# Altium project KeyBoard.PrjPcb
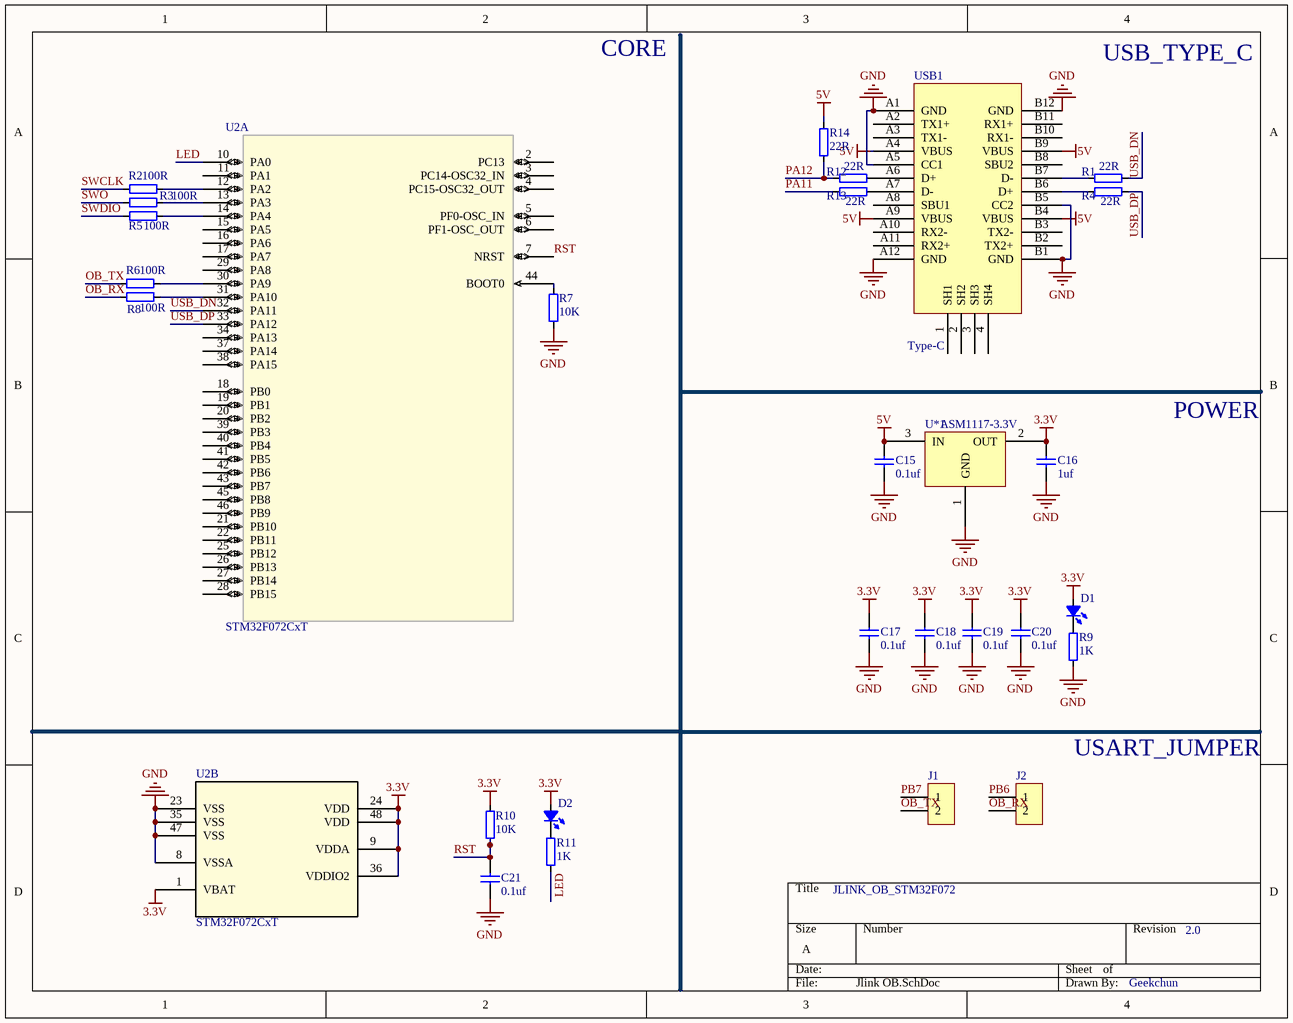
[diagram p0: Jlink OB.SchDoc]
3 sheets, 71 parts. Net scope: global (net labels, ports and power ports of the same name join across sheets).
Board file: KeyBoard.PcbDoc
Sheets:
  Jlink OB.SchDoc
  STM32F103C8T6.SchDoc
  Key&Led.SchDoc

## Sheet Jlink OB.SchDoc
size A

### Parts
C15  0.1uf  [C 0603_L]
C16  1uf  [C 0603_L]
C17  0.1uf  [C 0603_L]
C18  0.1uf  [C 0603_L]
C19  0.1uf  [C 0603_L]
C20  0.1uf  [C 0603_L]
C21  0.1uf  [C 0603_L]
D1  LED_0603  [LED 0603B]  (value not drawn)
D2  LED_0603  [LED 0603B]  (value not drawn)
J1  USART JUMPER  [HDR2.54-LI-2P]  (value not drawn)
J2  USART JUMPER  [HDR2.54-LI-2P]  (value not drawn)
R1  22R  [R 0603_L]
R2  100R  [R 0603_L]
R3  100R  [R 0603_L]
R4  22R  [R 0603_L]
R5  100R  [R 0603_L]
R6  100R  [R 0603_L]
R7  10K  [R 0603_L]
R8  100R  [R 0603_L]
R9  1K  [R 0603_L]
R10  10K  [R 0603_L]
R11  1K  [R 0603_L]
R12  22R  [R 0603_L]
R13  22R  [R 0603_L]
R14  22R  [R 0603_L]
U2  STM32F072CxT  [LQFP48 7X7_L]  (parts A,B of 2)
U*1  ASM1117-3.3V  [SOT223_L]
USB1  Type-C  [usb typec]

### Nets
3.3V: C16.2 C17.2 C18.2 C19.2 C20.2 D1.1(A) D2.1(A) R10.2 U2.1(VBAT) U2.9(VDDA) U2.24(VDD) U2.36(VDDIO2) U2.48(VDD) U*1.2(OUT)
5V: C15.2 R14.2 U*1.3(IN) USB1.A4(VBUS) USB1.A9(VBUS) USB1.B4(VBUS) USB1.B9(VBUS)
GND: C15.1 C16.1 C17.1 C18.1 C19.1 C20.1 C21.1 R7.2 R9.1 U2.8(VSSA) U2.23(VSS) U2.35(VSS) U2.47(VSS) U*1.1(GND) USB1.A1(GND) USB1.A5(CC1) USB1.A12(GND) USB1.B1(GND) USB1.B5(CC2) USB1.B12(GND)
LED: R11.1 U2.10(PA0)
OB_RX: J2.2 R8.1
OB_TX: J1.2 R6.1
PA11: R13.1
PA12: R12.1 R14.1
PB6: J2.1
PB7: J1.1
RST: C21.2 R10.1 U2.7(NRST)
SWCLK: R2.1
SWDIO: R5.1
SWO: R3.1
USB_DN: R1.2 U2.32(PA11)
USB_DP: R4.2 U2.33(PA12)
NetD1_2: D1.2(K) R9.2
NetD2_2: D2.2(K) R11.2
NetR1_1: R1.1 USB1.B7(D-)
NetR2_2: R2.2 U2.12(PA2)
NetR3_2: R3.2 U2.13(PA3)
NetR4_1: R4.1 USB1.B6(D+)
NetR5_2: R5.2 U2.14(PA4)
NetR6_2: R6.2 U2.30(PA9)
NetR7_1: R7.1 U2.44(BOOT0)
NetR8_2: R8.2 U2.31(PA10)
NetR12_2: R12.2 USB1.A6(D+)
NetR13_2: R13.2 USB1.A7(D-)

Not connected (* = marked no-connect by the designer): U2 2(PC13) 3(PC14-OSC32_IN) 4(PC15-OSC32_OUT) 5(PF0-OSC_IN) 6(PF1-OSC_OUT) 11(PA1) 15(PA5) 16(PA6) 17(PA7) 18(PB0) 19(PB1) 20(PB2) 21(PB10) 22(PB11) 25(PB12) 26(PB13) 27(PB14) 28(PB15) 29(PA8) 34(PA13) 37(PA14) 38(PA15) 39(PB3) 40(PB4) 41(PB5) 42(PB6) 43(PB7) 45(PB8) 46(PB9); USB1 1(SH1) 2(SH2) 3(SH3) 4(SH4) A2(TX1+) A3(TX1-) A8(SBU1) A10(RX2-) A11(RX2+) B2(TX2+) B3(TX2-) B8(SBU2) B10(RX1-) B11(RX1+)

### Notes on the sheet
- CORE
- USB_TYPE_C
- POWER
- USART_JUMPER
- JLINK_OB_STM32F072
- 2.0
- Geekchun

### Library data of the parts
C15-C21 = CAP: Capacitor, NP0, ?.1pF; Part Number: C0402-1.2p; Value: 1.2pF; Note: 50V; Artikkelnr Noca: 20029157; Artikkelnr Simpro: N.A.; Manufacturer: *; Manufacturer Part Number: *; Datasheet: *; LatestRevisionDate: 2011-05-11; Pin Count: 2; Publisher: Nordic Semiconductor; Published: 2009-05-08; Supplier: *; Supplier part number: *; 2nd source Supplier: *; 2nd source part number: *; Footprint Doc: 0402
D1 D2 = LED_0603: LED
J1 J2 = CON2: Connector
R1-R14 = RES
U2 = STM32F072CxT: Imported; Vendor: STMicroelectronics; C: Copyright (C) 2016 Accelerated Designs. All rights reserved; Copyright: Copyright (C) 2016 Accelerated Designs. All rights reserved; Manufacturer_Part_Number: stm32f072cxt; RefDes: RefDes; Type: Type; Value: Value
U*1 = ASM1117-3.3V: 三端可调或固定电压3.3V

## Sheet STM32F103C8T6.SchDoc: STM32F103C8T6 CORE
size OrCAD A; Author: Geekchun; DocumentNumber: 1.0; Revision: 1.0; SheetNumber: 1; SheetTotal: 3
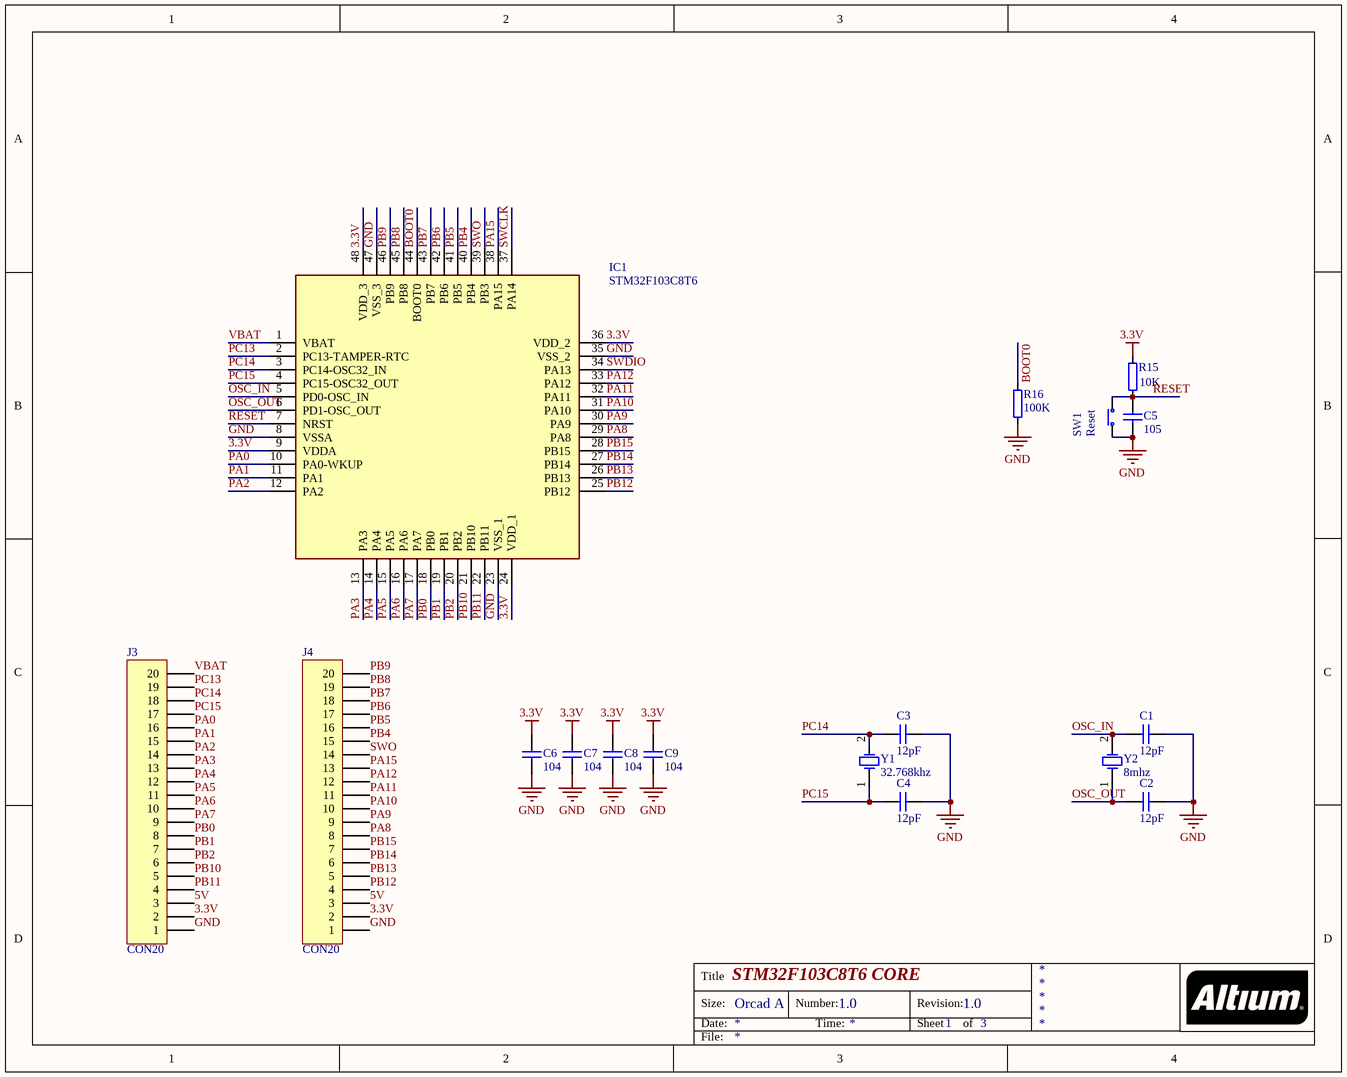
[diagram p1: STM32F103C8T6.SchDoc]

### Parts
C1  12pF  [C 0603_L]
C2  12pF  [C 0603_L]
C3  12pF  [C 0603_L]
C4  12pF  [C 0603_L]
C5  105  [C 0603_L]
C6  104  [C 0603_L]
C7  104  [C 0603_L]
C8  104  [C 0603_L]
C9  104  [C 0603_L]
IC1  STM32F103C8T6  [QFP50P900X900X160-48N]
J3  CON20  [HDR2.54-LI-20P]
J4  CON20  [HDR2.54-LI-20P]
R15  10K  [R 0603_L]
R16  100K  [R 0603_L]
SW1  Reset  [TSW SMD-6*6*5]
Y1  32.768khz  [OSC 3215-2P]
Y2  8mhz  [OSC 5032-2P]

### Nets
3.3V: C6.2 C7.2 C8.2 C9.2 IC1.9(VDDA) IC1.24(VDD_1) IC1.36(VDD_2) IC1.48(VDD_3) J3.2 J4.2 R15.2
5V: J3.3 J4.3
GND: C1.2 C2.2 C3.2 C4.2 C5.1 C6.1 C7.1 C8.1 C9.1 IC1.8(VSSA) IC1.23(VSS_1) IC1.35(VSS_2) IC1.47(VSS_3) J3.1 J4.1 R16.2 SW1.2(COM)
BOOT0: IC1.44(BOOT0) R16.1
OSC_IN: C1.1 IC1.5(PD0-OSC_IN) Y2.2
OSC_OUT: C2.1 IC1.6(PD1-OSC_OUT) Y2.1
PA0: IC1.10(PA0-WKUP) J3.16
PA1: IC1.11(PA1) J3.15
PA2: IC1.12(PA2) J3.14
PA3: IC1.13(PA3) J3.13
PA4: IC1.14(PA4) J3.12
PA5: IC1.15(PA5) J3.11
PA6: IC1.16(PA6) J3.10
PA7: IC1.17(PA7) J3.9
PA8: IC1.29(PA8) J4.8
PA9: IC1.30(PA9) J4.9
PA10: IC1.31(PA10) J4.10
PA11: IC1.32(PA11) J4.11
PA12: IC1.33(PA12) J4.12
PA15: IC1.38(PA15) J4.13
PB0: IC1.18(PB0) J3.8
PB1: IC1.19(PB1) J3.7
PB2: IC1.20(PB2) J3.6
PB4: IC1.40(PB4) J4.15
PB5: IC1.41(PB5) J4.16
PB6: IC1.42(PB6) J4.17
PB7: IC1.43(PB7) J4.18
PB8: IC1.45(PB8) J4.19
PB9: IC1.46(PB9) J4.20
PB10: IC1.21(PB10) J3.5
PB11: IC1.22(PB11) J3.4
PB12: IC1.25(PB12) J4.4
PB13: IC1.26(PB13) J4.5
PB14: IC1.27(PB14) J4.6
PB15: IC1.28(PB15) J4.7
PC13: IC1.2(PC13-TAMPER-RTC) J3.19
PC14: C3.1 IC1.3(PC14-OSC32_IN) J3.18 Y1.2
PC15: C4.1 IC1.4(PC15-OSC32_OUT) J3.17 Y1.1
RESET: C5.2 IC1.7(NRST) R15.1 SW1.1(N.O)
SWCLK: IC1.37(PA14)
SWDIO: IC1.34(PA13)
SWO: IC1.39(PB3) J4.14
VBAT: IC1.1(VBAT) J3.20

### Notes on the sheet
- Title
- Size:
- Date:
- Orcad A
- Number:
- Time:
- Revision:
- Sheet
- of
- File:

### Library data of the parts
C1-C9 = CAP: as C15 on sheet Jlink OB; Manufacturer: *; Manufacturer Part Number: *; Datasheet: *; LatestRevisionDate: 2011-05-11; Pin Count: 2; Publisher: Nordic Semiconductor; Published: 2009-05-08; Supplier: *; Supplier part number: *; 2nd source Supplier: *; 2nd source part number: *; Footprint Doc: 0402
IC1 = STM32F103C8T6: Integrated Circuit; Manufacturer_Name: STMicroelectronics; Datasheet Link: http://www.st.com/st-web-ui/static/active/en/resource/technical/document/datasheet/CD00161566.pdf; Height: 1.6mm; Manufacturer_Part_Number: STM32F103C8T6; Arrow Part Number: STM32F103C8T6; Arrow Price/Stock: https://www.arrow.com/en/products/stm32f103c8t6/stmicroelectronics; Mouser Part Number: 511-STM32F103C8T6; Mouser Price/Stock: https://www.mouser.co.uk/ProductDetail/STMicroelectronics/STM32F103C8T6?qs=bhCVus9SdFtq6kqxsU5%2FDA%3D%3D
J3 J4 = CON20: Connector
R15 R16 = RES
SW1 = SW-PB: Tactile Switch, SPNO, SMD, 160gf, 6.2x6.3x2.5mm; Part Number: Switch-PB-6.2x6.3mm-SMD; Manufacturer: Dailywell; Manufacturer Part Number: TS604VM1-025BR-R; 2nd source part number: 688-SKHUALE010; Value: PB SW; Artikkelnr Noca: 50019106; Artikkelnr Simpro: N.A.; Datasheet: \\hizz\pro\app9717\Datasheet\switches\Daliywell\TS604VM1-025BR-R.pdf; Footprint Doc: Switch-PB-6.2x6.3mm-SMD; LatestRevisionDate: 2016-04-21; Pin Count: 4; Publisher: Nordic Semiconductor; Published: 2010-02-01; Note: *; Supplier: Cabcon; Supplier part number: TS604VM1-025BR-R; 2nd source Supplier: Mouser
Y1 Y2 = XTAL: XTAL: 12MHZ

## Sheet Key&Led.SchDoc
size A4
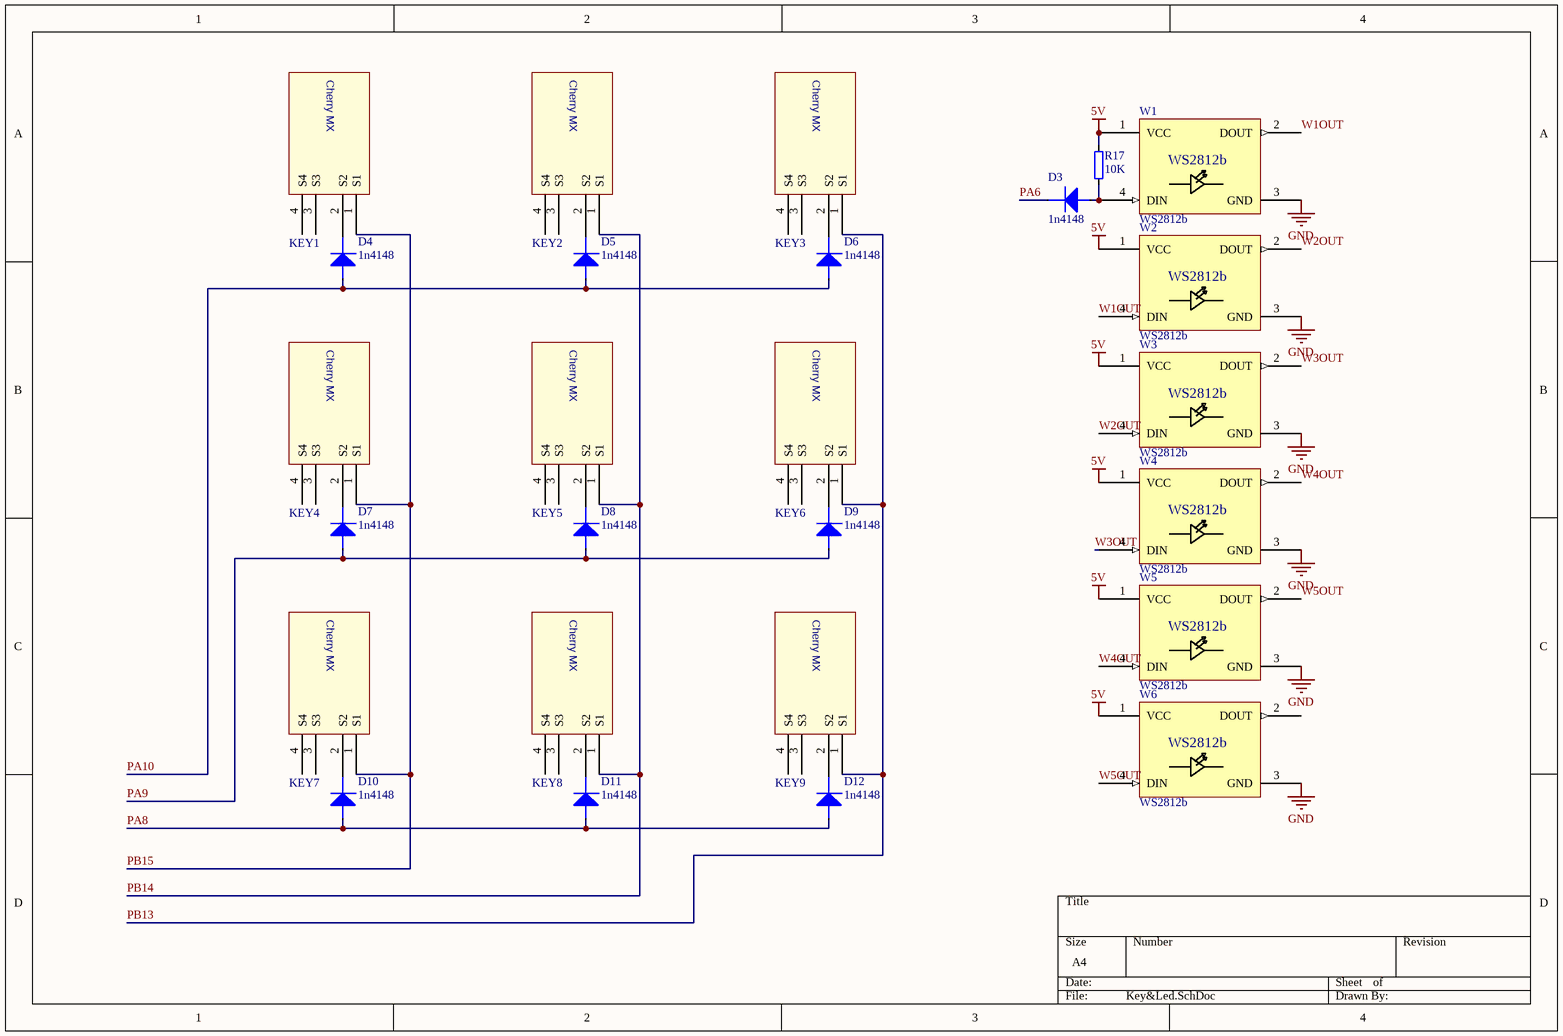
[diagram p2: Key&Led.SchDoc]

### Parts
D3  1n4148  [SOD-123]
D4  1n4148  [SOD-123]
D5  1n4148  [SOD-123]
D6  1n4148  [SOD-123]
D7  1n4148  [SOD-123]
D8  1n4148  [SOD-123]
D9  1n4148  [SOD-123]
D10  1n4148  [SOD-123]
D11  1n4148  [SOD-123]
D12  1n4148  [SOD-123]
KEY1  CHERRY_MX  [CHERRYMX]  (value not drawn)
KEY2  CHERRY_MX  [CHERRYMX]  (value not drawn)
KEY3  CHERRY_MX  [CHERRYMX]  (value not drawn)
KEY4  CHERRY_MX  [CHERRYMX]  (value not drawn)
KEY5  CHERRY_MX  [CHERRYMX]  (value not drawn)
KEY6  CHERRY_MX  [CHERRYMX]  (value not drawn)
KEY7  CHERRY_MX  [CHERRYMX]  (value not drawn)
KEY8  CHERRY_MX  [CHERRYMX]  (value not drawn)
KEY9  CHERRY_MX  [CHERRYMX]  (value not drawn)
R17  10K  [R 0603_L]
W1  WS2812b  [DIOC500500X250_NR]
W2  WS2812b  [DIOC500500X250_NR]
W3  WS2812b  [DIOC500500X250_NR]
W4  WS2812b  [DIOC500500X250_NR]
W5  WS2812b  [DIOC500500X250_NR]
W6  WS2812b  [DIOC500500X250_NR]

### Nets
5V: R17.1 W1.1(VCC) W2.1(VCC) W3.1(VCC) W4.1(VCC) W5.1(VCC) W6.1(VCC)
GND: W1.3(GND) W2.3(GND) W3.3(GND) W4.3(GND) W5.3(GND) W6.3(GND)
PA6: D3.2(K)
PA8: D10.1(A) D11.1(A) D12.1(A)
PA9: D7.1(A) D8.1(A) D9.1(A)
PA10: D4.1(A) D5.1(A) D6.1(A)
PB13: KEY3.1(S1) KEY6.1(S1) KEY9.1(S1)
PB14: KEY2.1(S1) KEY5.1(S1) KEY8.1(S1)
PB15: KEY1.1(S1) KEY4.1(S1) KEY7.1(S1)
W1OUT: W1.2(DOUT) W2.4(DIN)
W2OUT: W2.2(DOUT) W3.4(DIN)
W3OUT: W3.2(DOUT) W4.4(DIN)
W4OUT: W4.2(DOUT) W5.4(DIN)
W5OUT: W5.2(DOUT) W6.4(DIN)
NetD3_1: D3.1(A) R17.2 W1.4(DIN)
NetD4_2: D4.2(K) KEY1.2(S2)
NetD5_2: D5.2(K) KEY2.2(S2)
NetD6_2: D6.2(K) KEY3.2(S2)
NetD7_2: D7.2(K) KEY4.2(S2)
NetD8_2: D8.2(K) KEY5.2(S2)
NetD9_2: D9.2(K) KEY6.2(S2)
NetD10_2: D10.2(K) KEY7.2(S2)
NetD11_2: D11.2(K) KEY8.2(S2)
NetD12_2: D12.2(K) KEY9.2(S2)

Not connected (* = marked no-connect by the designer): KEY1 3(S3) 4(S4); KEY2 3(S3) 4(S4); KEY3 3(S3) 4(S4); KEY4 3(S3) 4(S4); KEY5 3(S3) 4(S4); KEY6 3(S3) 4(S4); KEY7 3(S3) 4(S4); KEY8 3(S3) 4(S4); KEY9 3(S3) 4(S4); W6 2(DOUT)

### Notes on the sheet
- (in symbol CHERRY_MX) Cherry MX

### Library data of the parts
D3-D12 = ZENER3: Zener Diode
R17 = RES
W1-W6 = WS2812b_Sumasta: The Infamous Chinese Chainable RGB LED

## Nets that join several sheets
3.3V: Jlink OB (14 pins), STM32F103C8T6 (11 pins)
5V: Jlink OB (7 pins), STM32F103C8T6 (J3.3 J4.3), Key&Led (7 pins)
GND: Jlink OB (20 pins), STM32F103C8T6 (17 pins), Key&Led (6 pins)
PA6: STM32F103C8T6 (IC1.16 J3.10), Key&Led (D3.2)
PA8: STM32F103C8T6 (IC1.29 J4.8), Key&Led (D10.1 D11.1 D12.1)
PA9: STM32F103C8T6 (IC1.30 J4.9), Key&Led (D7.1 D8.1 D9.1)
PA10: STM32F103C8T6 (IC1.31 J4.10), Key&Led (D4.1 D5.1 D6.1)
PA11: Jlink OB (R13.1), STM32F103C8T6 (IC1.32 J4.11)
PA12: Jlink OB (R12.1 R14.1), STM32F103C8T6 (IC1.33 J4.12)
PB6: Jlink OB (J2.1), STM32F103C8T6 (IC1.42 J4.17)
PB7: Jlink OB (J1.1), STM32F103C8T6 (IC1.43 J4.18)
PB13: STM32F103C8T6 (IC1.26 J4.5), Key&Led (KEY3.1 KEY6.1 KEY9.1)
PB14: STM32F103C8T6 (IC1.27 J4.6), Key&Led (KEY2.1 KEY5.1 KEY8.1)
PB15: STM32F103C8T6 (IC1.28 J4.7), Key&Led (KEY1.1 KEY4.1 KEY7.1)
SWCLK: Jlink OB (R2.1), STM32F103C8T6 (IC1.37)
SWDIO: Jlink OB (R5.1), STM32F103C8T6 (IC1.34)
SWO: Jlink OB (R3.1), STM32F103C8T6 (IC1.39 J4.14)